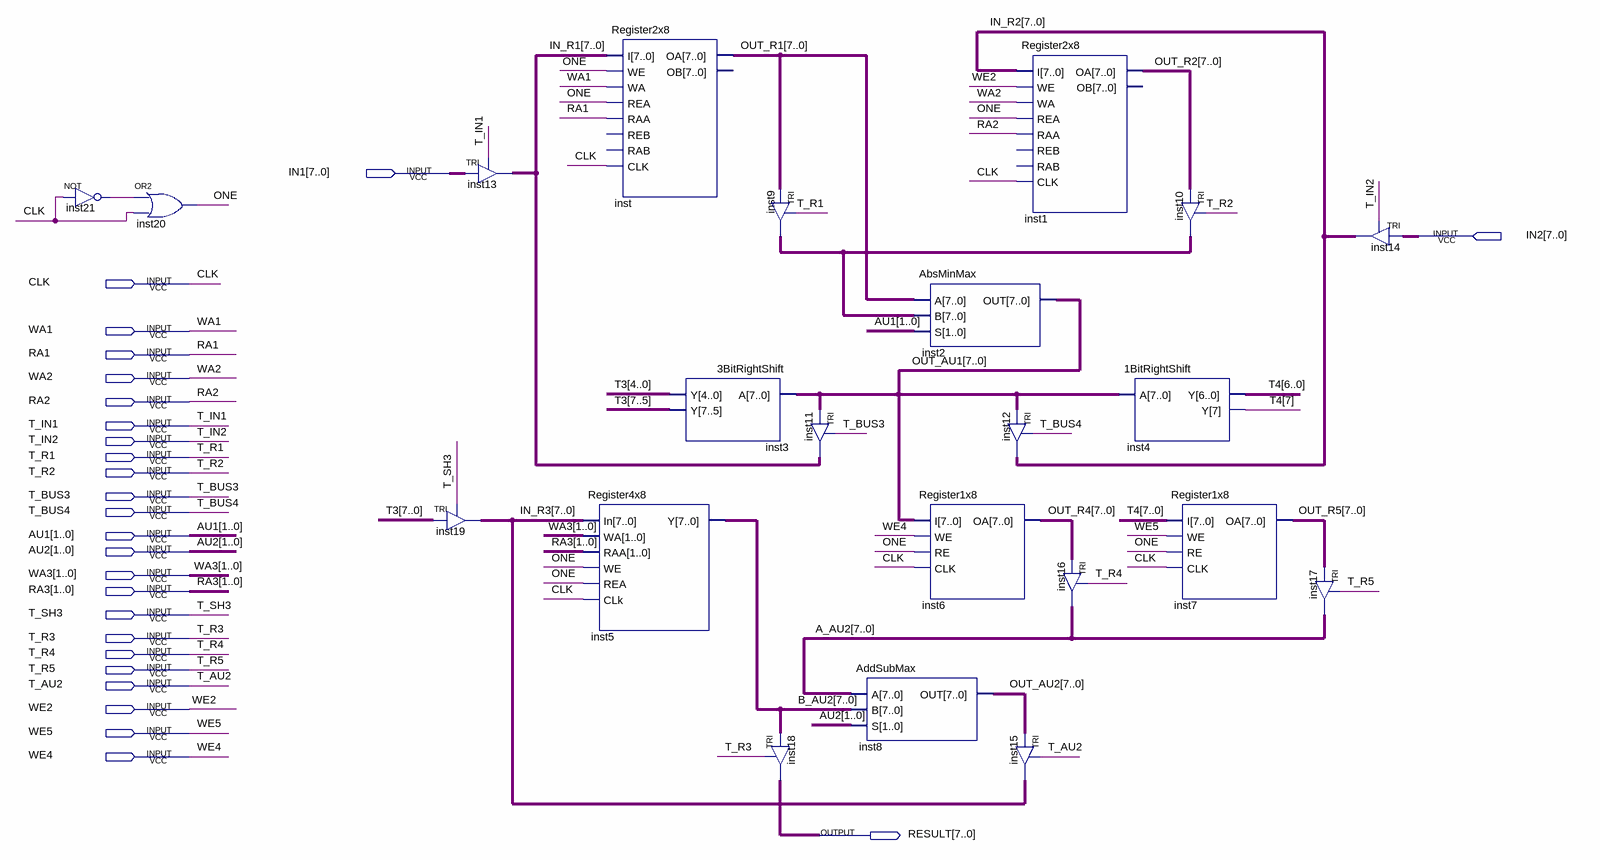
[diagram p0: schematic sheet]
// Quartus schematic DATAPATH.bdf as structural Verilog: 22 symbols, 26 pins
module DATAPATH (
  input  [7:0] IN1,
  input  [7:0] IN2,
  input  CLK,
  input  WA1,
  input  RA1,
  input  WA2,
  input  RA2,
  input  T_IN1,
  input  T_IN2,
  input  T_R1,
  input  T_R2,
  input  T_BUS3,
  input  T_BUS4,
  input  [1:0] AU1,
  input  [1:0] AU2,
  input  [1:0] WA3,
  input  [1:0] RA3,
  input  T_SH3,
  input  T_R3,
  input  T_R4,
  input  T_R5,
  input  T_AU2,
  input  WE2,
  input  WE5,
  input  WE4,
  output [7:0] RESULT
);

  wire inst21_out, ONE;
  wire [7:0] A_AU2, B_AU2, IN_R1, IN_R2, IN_R3, inst9_out, OUT_AU1, OUT_AU2, OUT_R1, OUT_R2, OUT_R4, OUT_R5,
       T3, T4;

  not inst21 (inst21_out, CLK);
  or inst20 (ONE, inst21_out, CLK);
  TRI inst19[7:0] (.IN(T3), .OE(T_SH3), .OUT(IN_R3));
  TRI inst13[7:0] (.IN(IN1), .OE(T_IN1), .OUT(IN_R1));
  Register2x8 inst (.I(IN_R1), .WE(ONE), .WA(WA1), .REA(ONE), .RAA(RA1), .CLK(CLK), .OA(OUT_R1));  // open: REB, RAB, OB
  Register4x8 inst5 (.In(IN_R3), .WA(WA3), .RAA(RA3), .WE(ONE), .REA(ONE), .CLk(CLK), .Y(B_AU2));
  \3BitRightShift  inst3 (.A(OUT_AU1), .Y(T3));
  TRI inst9[7:0] (.IN(OUT_R1), .OE(T_R1), .OUT(inst9_out));
  TRI inst11[7:0] (.IN(OUT_AU1), .OE(T_BUS3), .OUT(IN_R1));
  TRI inst18[7:0] (.IN(B_AU2), .OE(T_R3), .OUT(RESULT));
  AddSubMax inst8 (.A(A_AU2), .B(B_AU2), .S(AU2), .OUT(OUT_AU2));
  AbsMinMax inst2 (.A(OUT_R1), .B(inst9_out), .S(AU1), .OUT(OUT_AU1));
  Register1x8 inst6 (.I(OUT_AU1), .WE(WE4), .RE(ONE), .CLK(CLK), .OA(OUT_R4));
  TRI inst12[7:0] (.IN(OUT_AU1), .OE(T_BUS4), .OUT(IN_R2));
  TRI inst15[7:0] (.IN(OUT_AU2), .OE(T_AU2), .OUT(IN_R3));
  Register2x8 inst1 (
    .I(IN_R2), .WE(WE2), .WA(WA2), .REA(ONE), .RAA(RA2), .CLK(CLK), .OA(OUT_R2));  // open: REB, RAB, OB
  TRI inst16[7:0] (.IN(OUT_R4), .OE(T_R4), .OUT(A_AU2));
  \1BitRightShift  inst4 (.A(OUT_AU1), .Y(T4));
  TRI inst10[7:0] (.IN(OUT_R2), .OE(T_R2), .OUT(inst9_out));
  Register1x8 inst7 (.I(T4), .WE(WE5), .RE(ONE), .CLK(CLK), .OA(OUT_R5));
  TRI inst17[7:0] (.IN(OUT_R5), .OE(T_R5), .OUT(A_AU2));
  TRI inst14[7:0] (.IN(IN2), .OE(T_IN2), .OUT(IN_R2));
endmodule
